# Altium schematic sheet powerAmp.SchDoc
size B
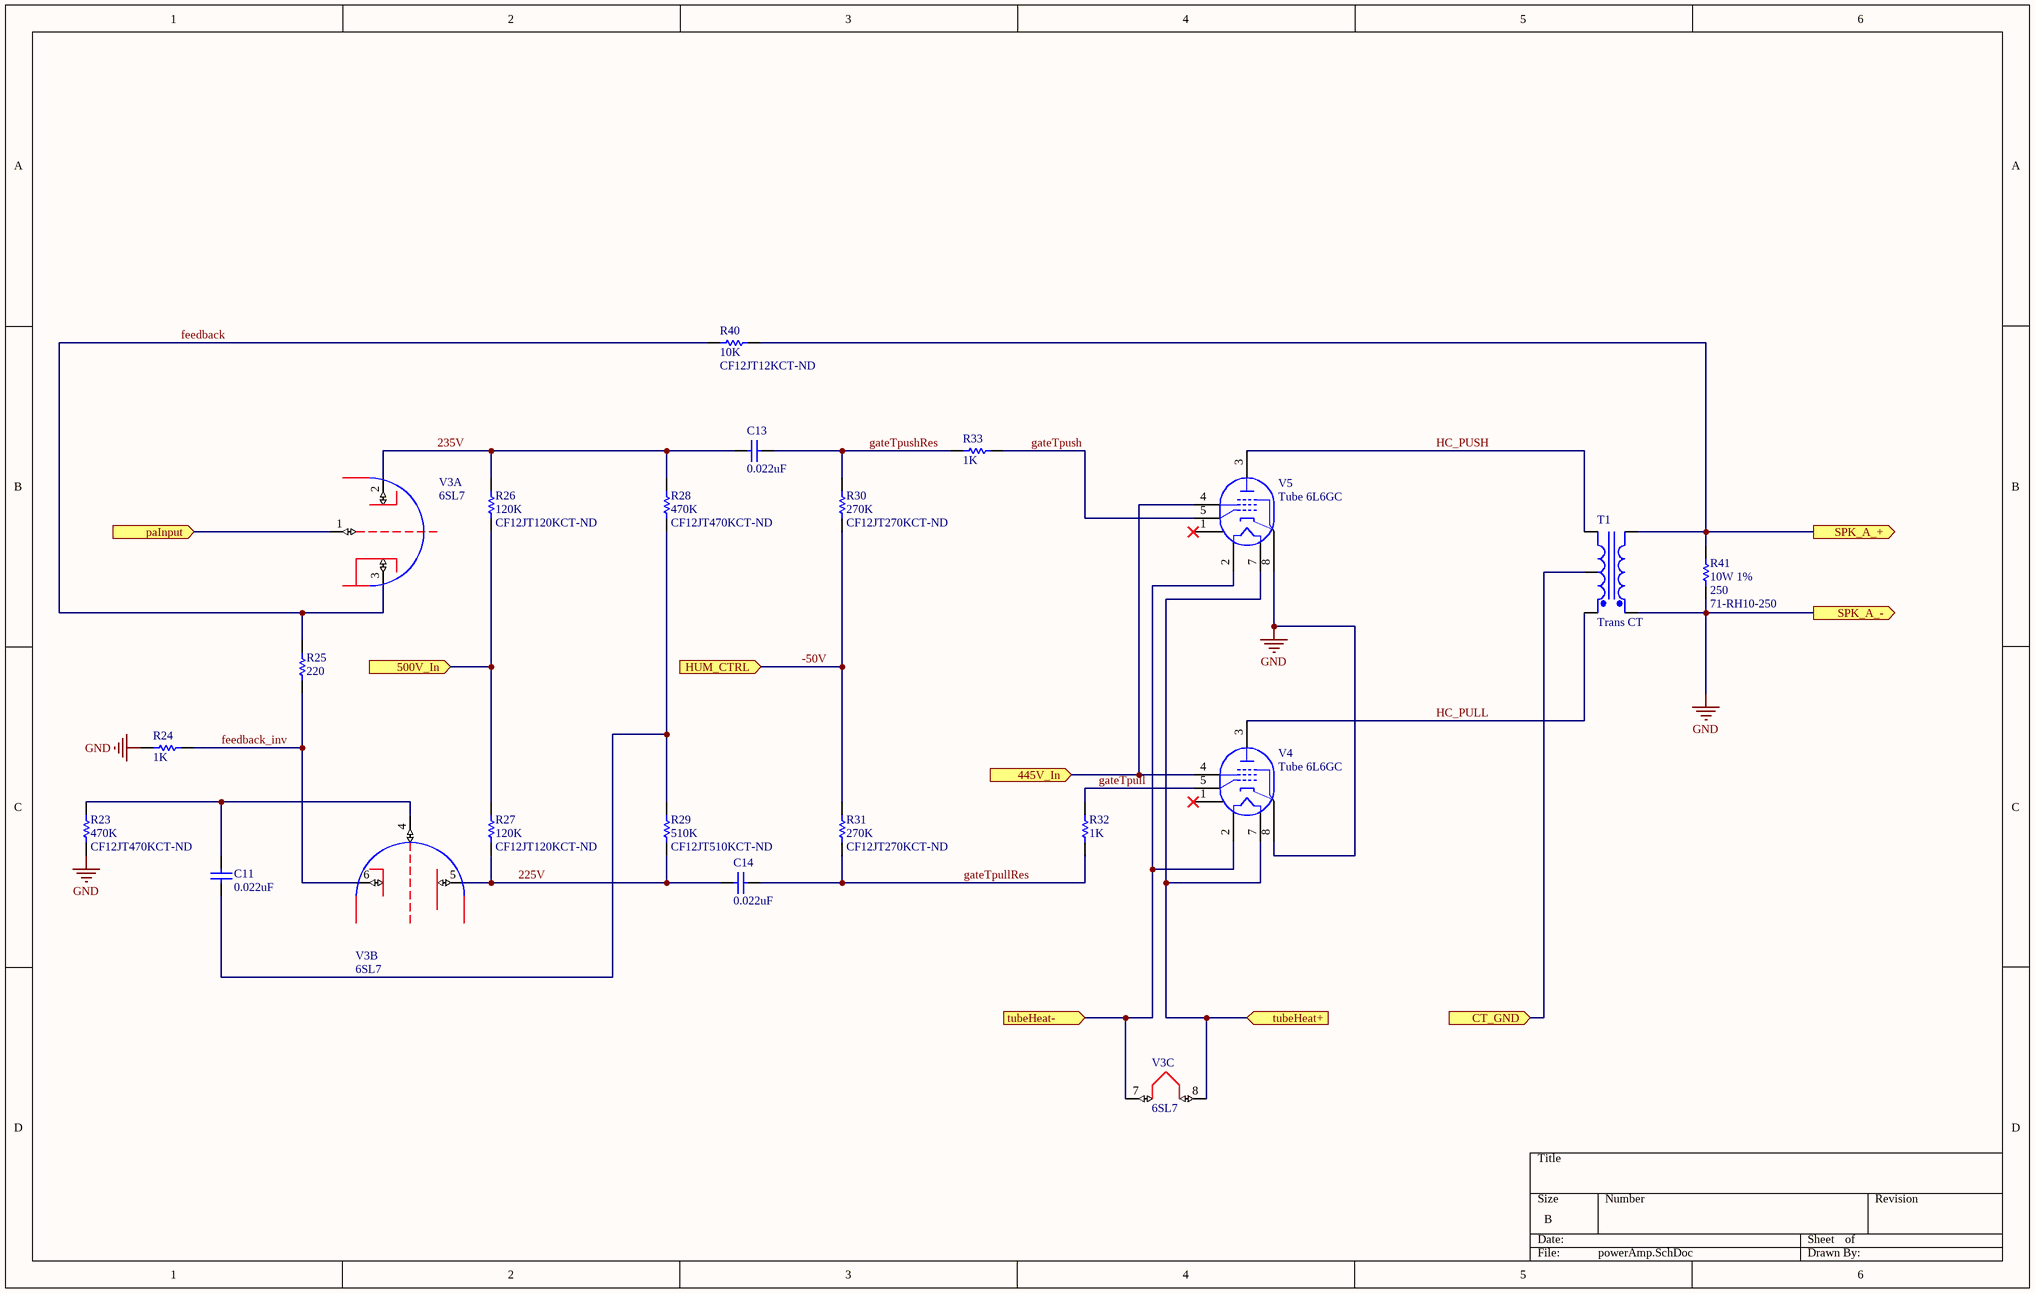
[diagram p0: powerAmp.SchDoc]

## Parts
C11  value 0.022uF  [RAD-0.3]  (hidden comment: Cap)
C13  value 0.022uF  [RAD-0.3]  (hidden comment: Cap)
C14  value 0.022uF  [RAD-0.3]  (hidden comment: Cap)
R23  value 470K  Supplier Part Number 1: CF12JT470KCT-ND  [AXIAL-0.3]  (hidden comment: Res1)
R24  value 1K  [AXIAL-0.3]  (hidden comment: Res1)
R25  value 220  [AXIAL-0.3]  (hidden comment: Res1)
R26  value 120K  Supplier Part Number 1: CF12JT120KCT-ND  [AXIAL-0.3]  (hidden comment: Res1)
R27  value 120K  Supplier Part Number 1: CF12JT120KCT-ND  [AXIAL-0.3]  (hidden comment: Res1)
R28  value 470K  Supplier Part Number 1: CF12JT470KCT-ND  [AXIAL-0.3]  (hidden comment: Res1)
R29  value 510K  Supplier Part Number 1: CF12JT510KCT-ND  [AXIAL-0.3]  (hidden comment: Res1)
R30  value 270K  Supplier Part Number 1: CF12JT270KCT-ND  [AXIAL-0.3]  (hidden comment: Res1)
R31  value 270K  Supplier Part Number 1: CF12JT270KCT-ND  [AXIAL-0.3]  (hidden comment: Res1)
R32  value 1K  [AXIAL-0.3]  (hidden comment: Res1)
R33  value 1K  [AXIAL-0.3]  (hidden comment: Res1)
R40  value 10K  Supplier Part Number 1: CF12JT12KCT-ND  [AXIAL-0.3]  (hidden comment: Res1)
R41  10W 1%  value 250  Supplier Part Number 1: 71-RH10-250  [AXIAL-0.3]
T1  Trans CT  [HDR1X5]
V3  6SL7  [OCTALSOCKET]  (parts A,B,C of 3)
V4  Tube 6L6GC  [OCTALSOCKET]
V5  Tube 6L6GC  [OCTALSOCKET]

## Ports
445V_In (in), 500V_In (in), CT_GND (in), HUM_CTRL (in), paInput (in), SPK_A_+ (out), SPK_A_- (out), tubeHeat+ (in), tubeHeat- (in)

## Nets
GND: R23.2 R24.2 R41.1 T1.1(Pri+) V4.8(G3,_KT) V5.8(G3,_KT) ; port SPK_A_-
225V: C14.1 R27.1 R29.2 V3.5(topPlate)
235V: C13.1 R26.2 R28.1 V3.2(topPlate)
445V_In: V4.4(GT2) V5.4(GT2) ; port 445V_In
500V_In: R26.1 R27.2 ; port 500V_In
-50V: R30.1 R31.2 ; port HUM_CTRL
CT_GND: T1.4(SecCT) ; port CT_GND
feedback: R25.2 R40.2 V3.3(topPlate)
feedback_inv: R24.1 R25.1 V3.6(topPlate)
gateTpull: R32.1 V4.5(GT1)
gateTpullRes: C14.2 R31.1 R32.2
gateTpush: R33.1 V5.5(GT1)
gateTpushRes: C13.2 R30.2 R33.2
HC_PULL: T1.3(Sec+) V4.3(PT)
HC_PUSH: T1.5(Sec-) V5.3(PT)
paInput: V3.1(gate) ; port paInput
SPK_A_+: R40.1 R41.2 T1.2(Pri-) ; port SPK_A_+
tubeHeat+: V3.8 V4.7(H) V5.7(H) ; port tubeHeat+
tubeHeat-: V3.7 V4.2(H) V5.2(H) ; port tubeHeat-
NetC11_1: C11.1 R28.2 R29.1
NetC11_2: C11.2 R23.1 V3.4(gate)

Not connected (* = marked no-connect by the designer): V4 1(NC)*; V5 1(NC)*

## Library data of the parts
C11 C13 C14 = Cap: Capacitor; Published: 8-Jun-2000; LatestRevisionDate: 17-Jul-2002; LatestRevisionNote: Re-released for DXP Platform.; PackageReference: RAD-0.3; Publisher: Altium Limited; PackageDescription: Radial Cap, Thru-Hole; 2 Leads; 0.3 in Pin Spacing
R23-R33 R40 R41 = Res1: Resistor; Published: 8-Jun-2000; LatestRevisionDate: 17-Jul-2002; LatestRevisionNote: Re-released for DXP Platform.; PackageReference: AXIAL-0.3; Publisher: Altium Limited; PackageDescription: Axial Device, Thru-Hole; 2 Leads; 0.3 in Pin Spacing
  R23 R26-R31 R40: Supplier 1: Digi-Key
  R41: Supplier 1: Mouser
T1 = Trans CT: Center-Tapped Transformer (Coupled Inductor Model); Published: 8-Jun-2000; LatestRevisionDate: 17-Jul-2002; LatestRevisionNote: Re-released for DXP Platform.; PackageReference: TRF_5; Publisher: Altium Limited; PackageDescription: Transformer; 5 Leads
V4 V5 = Tube 6L6GC: Beam Power Pentode; Note: Pin 6 is omitted from the tube package, Pin 1 is Not Connected; Published: 8-Jun-2000; LatestRevisionDate: 17-Jul-2002; LatestRevisionNote: Re-released for DXP Platform.; PackageReference: VTUBE-7; Publisher: Altium Limited; PackageDescription: Vacuum Tube; 7 Leads